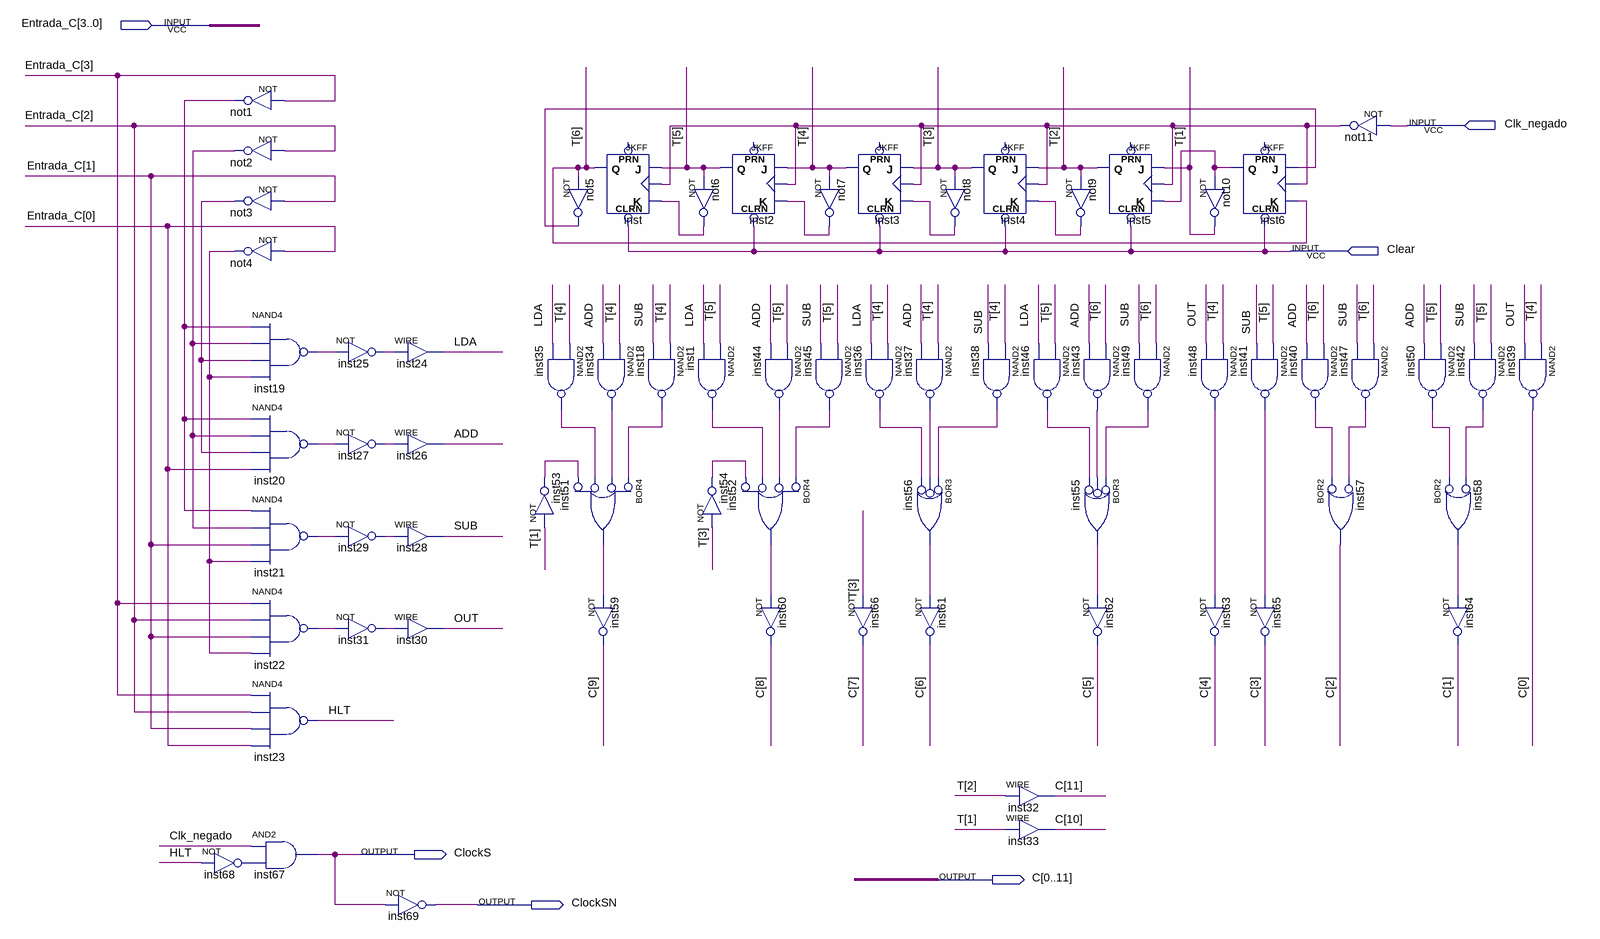
[diagram p0: schematic sheet]
// Quartus schematic Controlador_sequenciador.bdf as structural Verilog: 70 symbols, 6 pins
module Controlador_sequenciador (
  input  [3:0] Entrada_C,
  input  Clk_negado,
  input  Clear,
  output ClockS,
  output [0:11] C,
  output ClockSN
);

  wire ADD, HLT, inst1_out, inst6_q, inst18_out, inst19_out, inst20_out, inst21_out, inst22_out, inst25_out,
       inst27_out, inst29_out, inst31_out, inst34_out, inst35_out, inst36_out, inst37_out, inst38_out,
       inst40_out, inst41_out, inst42_out, inst43_out, inst44_out, inst45_out, inst46_out, inst47_out,
       inst48_out, inst49_out, inst50_out, inst51_out, inst52_out, inst53_out, inst54_out, inst55_out,
       inst56_out, inst58_out, inst68_out, LDA, not1_out, not2_out, not3_out, not4_out, not5_out, not6_out,
       not7_out, not8_out, not9_out, not11_out, OUT, SUB;
  wire [6:1] T;

  not not1 (not1_out, Entrada_C[3]);
  not not2 (not2_out, Entrada_C[2]);
  not not3 (not3_out, Entrada_C[1]);
  not not4 (not4_out, Entrada_C[0]);
  not inst68 (inst68_out, HLT);
  nand inst19 (inst19_out, not1_out, not2_out, not3_out, not4_out);
  nand inst20 (inst20_out, not1_out, not2_out, not3_out, Entrada_C[0]);
  nand inst21 (inst21_out, not1_out, not2_out, Entrada_C[1], not4_out);
  nand inst22 (inst22_out, Entrada_C[3], Entrada_C[2], Entrada_C[1], not4_out);
  nand inst23 (HLT, Entrada_C[3], Entrada_C[2], Entrada_C[1], Entrada_C[0]);
  and inst67 (ClockS, Clk_negado, inst68_out);
  not inst25 (inst25_out, inst19_out);
  not inst27 (inst27_out, inst20_out);
  not inst29 (inst29_out, inst21_out);
  not inst31 (inst31_out, inst22_out);
  assign LDA = inst25_out;  // WIRE inst24
  assign ADD = inst27_out;  // WIRE inst26
  assign SUB = inst29_out;  // WIRE inst28
  assign OUT = inst31_out;  // WIRE inst30
  not inst69 (ClockSN, ClockS);
  not not5 (not5_out, T[6]);
  nand inst35 (inst35_out, T[4], LDA);
  or inst51 (inst51_out, ~inst18_out, ~inst34_out, ~inst35_out, ~inst53_out);  // BOR4
  not inst53 (inst53_out, T[1]);
  JKFF inst (.CLRN(Clear), .K(not6_out), .J(T[5]), .CLK(not11_out), .Q(T[6]));  // open: PRN
  nand inst18 (inst18_out, T[4], SUB);
  nand inst34 (inst34_out, T[4], ADD);
  not inst59 (C[9], inst51_out);
  not not6 (not6_out, T[5]);
  nand inst1 (inst1_out, T[5], LDA);
  not inst54 (inst54_out, T[3]);
  JKFF inst2 (.CLRN(Clear), .K(not7_out), .J(T[4]), .CLK(not11_out), .Q(T[5]));  // open: PRN
  nand inst44 (inst44_out, T[5], ADD);
  or inst52 (inst52_out, ~inst45_out, ~inst44_out, ~inst1_out, ~inst54_out);  // BOR4
  not inst60 (C[8], inst52_out);
  JKFF inst3 (.CLRN(Clear), .K(not8_out), .J(T[3]), .CLK(not11_out), .Q(T[4]));  // open: PRN
  not not7 (not7_out, T[4]);
  nand inst45 (inst45_out, T[5], SUB);
  not inst66 (C[7], T[3]);
  nand inst36 (inst36_out, T[4], LDA);
  nand inst37 (inst37_out, T[4], ADD);
  or inst56 (inst56_out, ~inst38_out, ~inst37_out, ~inst36_out);  // BOR3
  not inst61 (C[6], inst56_out);
  JKFF inst4 (.CLRN(Clear), .K(not9_out), .J(T[2]), .CLK(not11_out), .Q(T[3]));  // open: PRN
  not not8 (not8_out, T[3]);
  nand inst38 (inst38_out, T[4], SUB);
  nand inst46 (inst46_out, T[5], LDA);
  assign C[11] = T[2];  // WIRE inst32
  assign C[10] = T[1];  // WIRE inst33
  JKFF inst5 (.CLRN(Clear), .K(inst6_q), .J(T[1]), .CLK(not11_out), .Q(T[2]));  // open: PRN
  not not9 (not9_out, T[2]);
  nand inst43 (inst43_out, T[6], ADD);
  or inst55 (inst55_out, ~inst49_out, ~inst43_out, ~inst46_out);  // BOR3
  not inst62 (C[5], inst55_out);
  nand inst49 (inst49_out, T[6], SUB);
  JKFF inst6 (.CLRN(Clear), .K(T[6]), .J(not5_out), .CLK(not11_out), .Q(inst6_q));  // open: PRN
  not not10 (T[1], inst6_q);
  nand inst41 (inst41_out, T[5], SUB);
  nand inst48 (inst48_out, T[4], OUT);
  not inst63 (C[4], inst48_out);
  not inst65 (C[3], inst41_out);
  nand inst40 (inst40_out, T[6], ADD);
  or inst57 (C[2], ~inst40_out, ~inst47_out);  // BOR2
  not not11 (not11_out, Clk_negado);
  nand inst47 (inst47_out, T[6], SUB);
  nand inst50 (inst50_out, T[5], ADD);
  or inst58 (inst58_out, ~inst50_out, ~inst42_out);  // BOR2
  not inst64 (C[1], inst58_out);
  nand inst39 (C[0], T[4], OUT);
  nand inst42 (inst42_out, T[5], SUB);
endmodule
